# Altium schematic sheet MCU_SCHEM_REV1.SchDoc
size A4; SheetNumber: 1; SheetTotal: 1
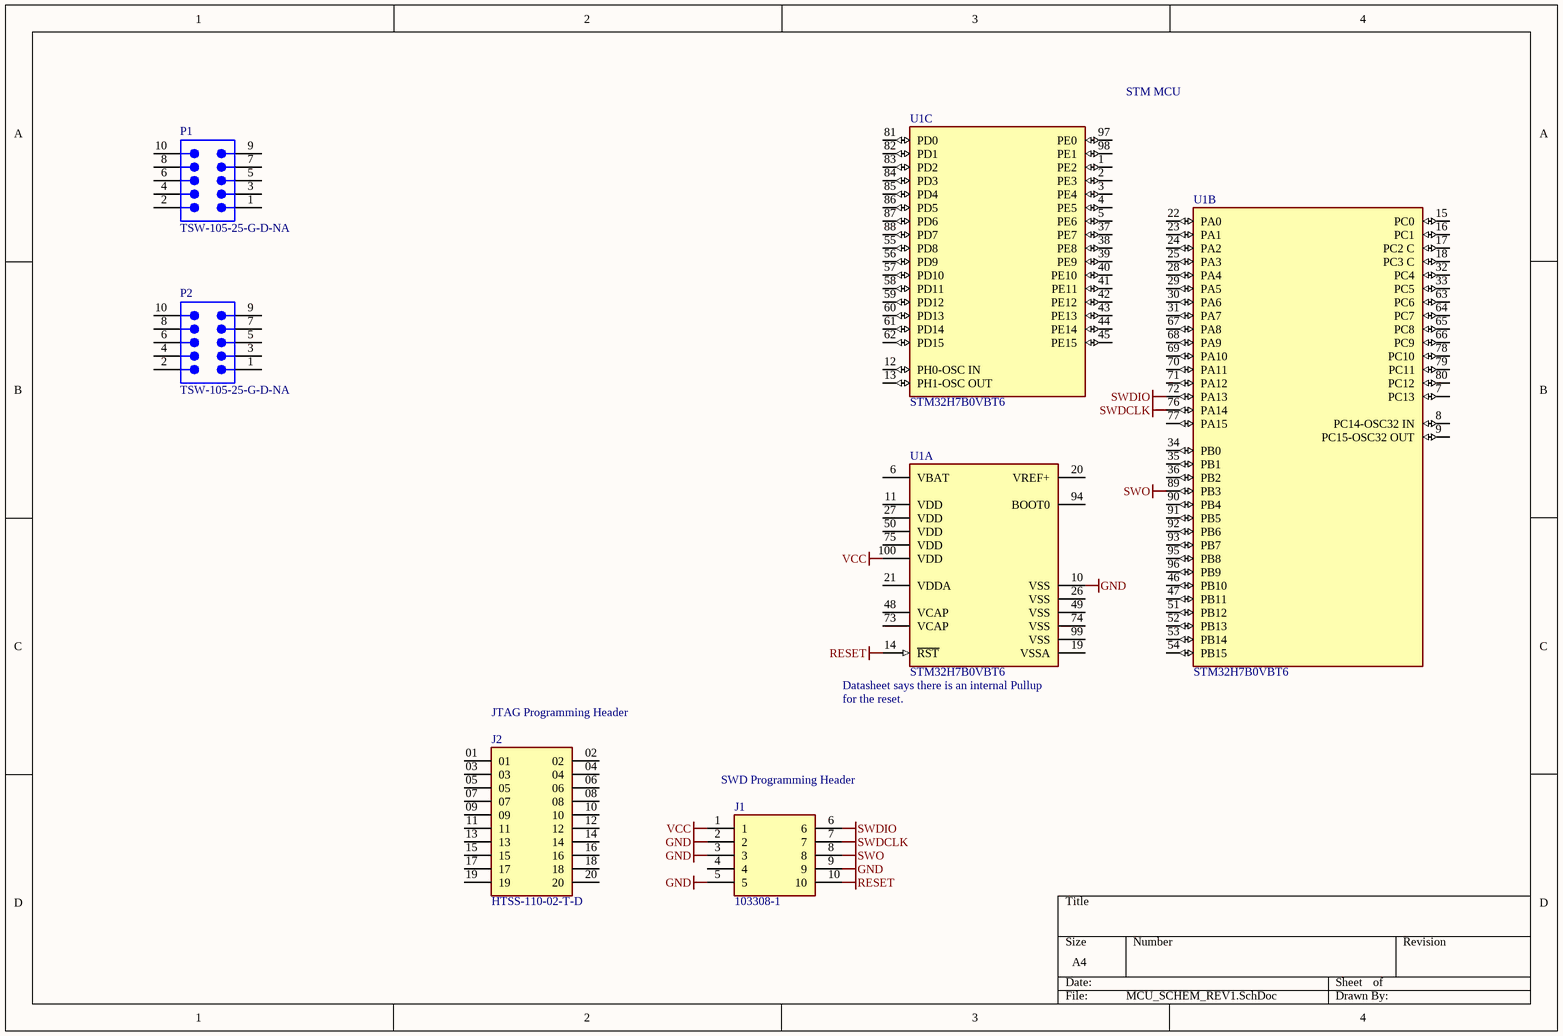
[diagram p0: MCU_SCHEM_REV1.SchDoc]

## Parts
J1  103308-1  [TE_103308-1]
J2  HTSS-110-02-T-D  [SAMTEC_HTSS-110-02-T-D]
P1  TSW-105-25-G-D-NA  [SMTC-TSW-105-25-X-D-NA]
P2  TSW-105-25-G-D-NA  [SMTC-TSW-105-25-X-D-NA]
U1  STM32H7B0VBT6  [FP-LQFP100-MFG]  (parts A,B,C of 3)

## Nets
GND: J1.2 J1.3 J1.5 J1.9 U1.10(VSS)
RESET: J1.10 U1.14(~{RST})
SWDCLK: J1.7 U1.76(PA14)
SWDIO: J1.6 U1.72(PA13)
SWO: J1.8 U1.89(PB3)
VCC: J1.1 U1.100(VDD)

Not connected (* = marked no-connect by the designer): J1 4; J2 01 02 03 04 05 06 07 08 09 10 11 12 13 14 15 16 17 18 19 20; P1 1 2 3 4 5 6 7 8 9 10; P2 1 2 3 4 5 6 7 8 9 10; U1 1(PE2) 2(PE3) 3(PE4) 4(PE5) 5(PE6) 6(VBAT) 7(PC13) 8(PC14-OSC32_IN) 9(PC15-OSC32_OUT) 11(VDD) 12(PH0-OSC_IN) 13(PH1-OSC_OUT) 15(PC0) 16(PC1) 17(PC2_C) 18(PC3_C) 19(VSSA) 20(VREF+) 21(VDDA) 22(PA0) 23(PA1) 24(PA2) 25(PA3) 26(VSS) 27(VDD) 28(PA4) 29(PA5) 30(PA6) 31(PA7) 32(PC4) 33(PC5) 34(PB0) 35(PB1) 36(PB2) 37(PE7) 38(PE8) 39(PE9) 40(PE10) 41(PE11) 42(PE12) 43(PE13) 44(PE14) 45(PE15) 46(PB10) 47(PB11) 48(VCAP) 49(VSS) 50(VDD) 51(PB12) 52(PB13) 53(PB14) 54(PB15) 55(PD8) 56(PD9) 57(PD10) 58(PD11) 59(PD12) 60(PD13) 61(PD14) 62(PD15) 63(PC6) 64(PC7) 65(PC8) 66(PC9) 67(PA8) 68(PA9) 69(PA10) 70(PA11) 71(PA12) 73(VCAP) 74(VSS) 75(VDD) 77(PA15) 78(PC10) 79(PC11) 80(PC12) 81(PD0) 82(PD1) 83(PD2) 84(PD3) 85(PD4) 86(PD5) 87(PD6) 88(PD7) 90(PB4) 91(PB5) 92(PB6) 93(PB7) 94(BOOT0) 95(PB8) 96(PB9) 97(PE0) 98(PE1) 99(VSS)

## Notes on the sheet
- STM MCU
- (near J2) JTAG Programming Header
- (near U1) Datasheet says there is an internal Pullup
- (near U1) for the reset.
- (near J1) SWD Programming Header

## Library data of the parts
J1 = 103308-1: Header;  Pin;  Vertical;  Copper Alloy;  Thermoplastic;  10;  0.100 x 0.100 in.;  1 A; MF: TE Connectivity; Package: None; MP: 103308-1; Value: *; Price: None; Availability: Unavailable; SnapEDA_Link: https://www.snapeda.com/parts/103308-1/TE%20Connectivity%20AMP%20Connectors/view-part/519501/?ref=snap
J2 = HTSS-110-02-T-D: Connector Header Through Hole 20 position 0.100 (2.54mm); MF: Samtec; Package: None; Value: *; Availability: Unavailable; SnapEDA_Link: https://www.snapeda.com/parts/HTSS-110-02-T-D/Samtec/view-part/2878126/?ref=snap; Price: None; MP: HTSS-110-02-T-D
P1 P2 = CMP-1024-00371-1: 0.025" SQ Post Header, Through-hole, Right Angle, -55 to 125 degC, 2.54 mm Pitch, 10-Pin, Male, RoHS; Manufacturer: Samtec; Pitch: 2.54 mm; Orientation: Right Angle; ComponentLink2URL: http://www.samtec.com/documents/webfiles/pdf/TSW_TH.PDF; PackageDescription: .025[0.64] SQ. Post Terminal Strip Assembly; ComponentLink1URL: http://www.samtec.com; ComponentLink2Description: Datasheet; PackageReference: TSW-105-25-X-D-NA; RoHS: True; PartNumber: TSW-105-25-G-D-NA; ComponentLink3URL: http://www.samtec.com/documents/webfiles/cpdf/TSW-XXX-XX-XXX-X-XX-XXX-MKT.pdf; DatasheetVersion: F-214; ComponentLink3Description: Package Specification; Temperature Range: -55 to 125 degC; ComponentLink1Description: Manufacturer URL; Mounting Technology: Through-hole; PackageVersion: DM, 8/1988
U1 = CMP-12105-000109-1: IC MCU 32BIT 128KB FLASH 100LQFP